# Altium schematic sheet PCIe_x1_edge.SchDoc: <title>
size C; CopyrightDate: 2014; Organization: Custom Embedded Solutions, LLC.; Address1: 130 Oakland Trace; Address2: Madison, AL 35758; DocumentNumber: <doc_num>; Revision: <Rev>; SheetNumber: 4; SheetTotal: 8; PageTitle: PCI Express x1 Edge Connector
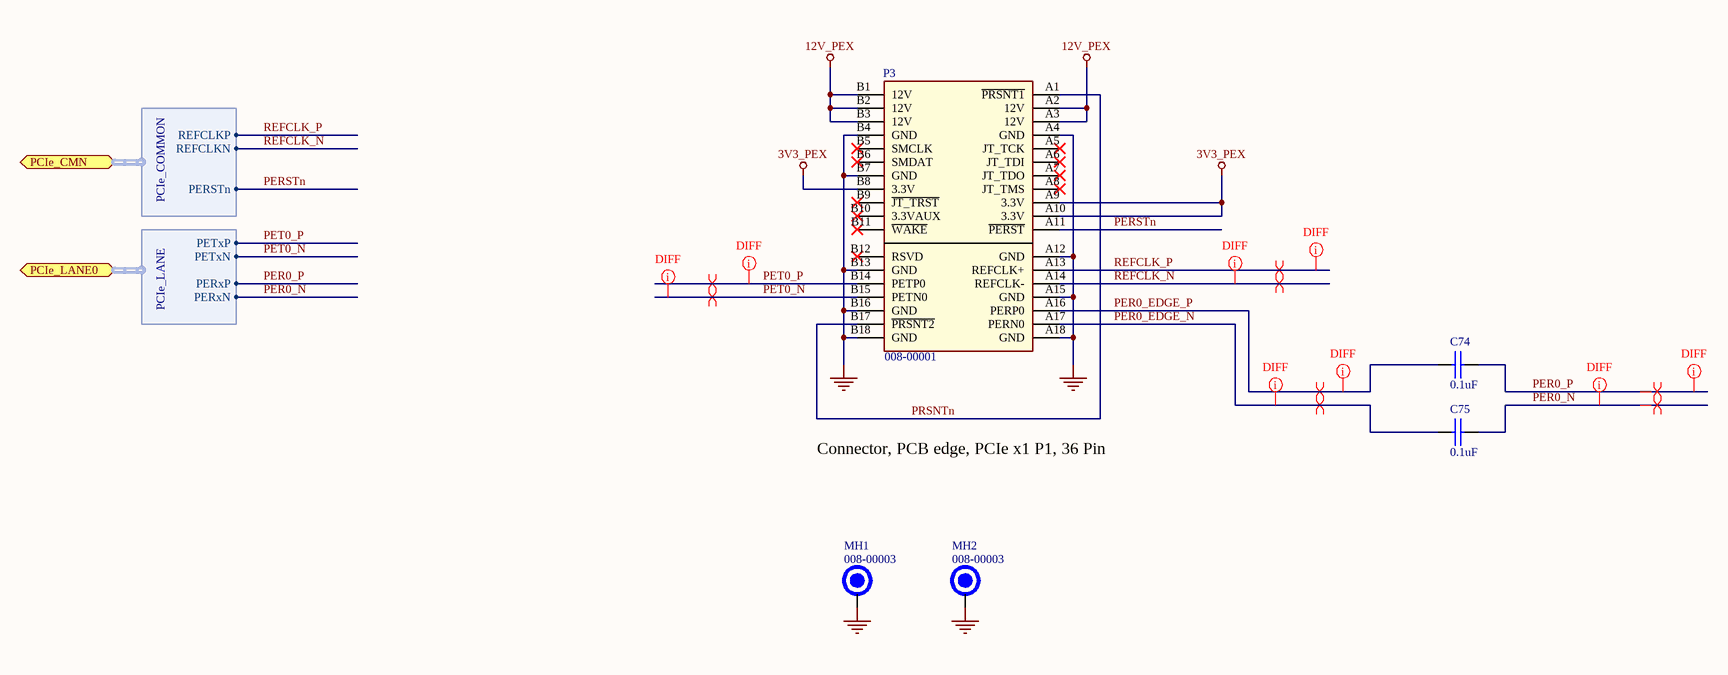
[diagram p0: PCIe_x1_edge.SchDoc]

## Parts
C74  0.1uF  [005-00008]
C75  0.1uF  [005-00008]
MH1  Part Number: 008-00003  [005-00019]  (hidden comment: 004-00017)  (no BOM)
MH2  Part Number: 008-00003  [005-00019]  (hidden comment: 004-00017)  (no BOM)
P3  Part Number: 008-00001  [005-00020]  (hidden comment: 004-00018)  (no BOM)

## Ports
PCIe_CMN (harness PCIe_COMMON), PCIe_LANE0 (harness PCIe_LANE)

## Harnesses
PCIe_COMMON: PERSTn, REFCLKP, REFCLKN
PCIe_LANE: PETxP, PETxN, PERxP, PERxN

## Nets
3V3_PEX: P3.A9(3.3V) P3.A10(3.3V) P3.B8(3.3V)
12V_PEX: P3.A2(12V) P3.A3(12V) P3.B1(12V) P3.B2(12V) P3.B3(12V)
GND: MH1.1 MH2.1 P3.A4(GND) P3.A12(GND) P3.A15(GND) P3.A18(GND) P3.B4(GND) P3.B7(GND) P3.B13(GND) P3.B16(GND) P3.B18(GND)
PER0_EDGE_N: C75.1 P3.A17(PERN0)
PER0_EDGE_P: C74.1 P3.A16(PERP0)
PER0_N: C75.2 ; port PCIe_LANE0.PERxN
PER0_P: C74.2 ; port PCIe_LANE0.PERxP
PERSTn: P3.A11(~{PERST}) ; port PCIe_CMN.PERSTn
PET0_N: P3.B15(PETN0) ; port PCIe_LANE0.PETxN
PET0_P: P3.B14(PETP0) ; port PCIe_LANE0.PETxP
PRSNTn: P3.A1(~{PRSNT1}) P3.B17(~{PRSNT2})
REFCLK_N: P3.A14(REFCLK-) ; port PCIe_CMN.REFCLKN
REFCLK_P: P3.A13(REFCLK+) ; port PCIe_CMN.REFCLKP

Not connected (* = marked no-connect by the designer): P3 A5(JT_TCK)* A6(JT_TDI)* A7(JT_TDO)* A8(JT_TMS)* B5(SMCLK)* B6(SMDAT)* B9(~{JT_TRST})* B10(3.3VAUX)* B11(~{WAKE})* B12(RSVD)*

## Layout directives
differential pair: PER0_EDGE_N, PER0_EDGE_P, PER0_N, PER0_P, PET0_N, PET0_P, REFCLK_N, REFCLK_P
rule Matched Net Lengths [Tolerance = 25mil]; rule Differential Pairs Routing [Pref Gap = 0.125mm    Min Gap  = 0.125mm    Max Gap  = 1mmPref Width = 0.264mm    Min Width  = 0.095mm    Max Width  = 0.264mm]: PER0_EDGE_N, PER0_EDGE_P, PER0_N, PER0_P, PET0_N, PET0_P, REFCLK_N, REFCLK_P

## Notes on the sheet
- Connector, PCB edge, PCIe x1 P1, 36 Pin
- Copyright (c)
- Page Title
- Design Title
- Creative Commons License, http://creativecommons.org/licenses/by/4.0/legalcode
  This PCB design by Custom Embedded Solutions, LLC. is licensed under a Creative Commons Attribution 4.0 International License.
- Size:
- Date:
- File:
- C
- Document Number:
- Time:
- Sheet
- Rev:
- of

## Library data of the parts
C74 C75 = 011-00011: Capacitor 0.1uF 16V 10% 0402 X7R; Manufacturer1 Part Number: C0402C104K4RACT; Manufacturer1: Kemet; 3rd Party: {Reference Design}; Type: Ceramic; Types: X1; Part Number: 011-00011; Voltage: 16V; Substrate: X7R; Value: 0.1uF; Package: 1005, EIA 0402, Chip Capacitor, 2-Leads, Body 1.00x0.50mm, IPC High Density
MH1 MH2 = 008-00003: PCB Mounting Hole, Round Pad, 250mil Diameter, 125mil Drill; Types: Fiducial; Package: PCB Mounting Hole, Round Pad, 250mil Diameter, 125mil Drill
P3 = 008-00001: Connector, PCB edge, PCIe x1 P1, 36 Pin; Types: Connector; Package: Edge Connector, PCI Express x1 (1mm, 36 position)